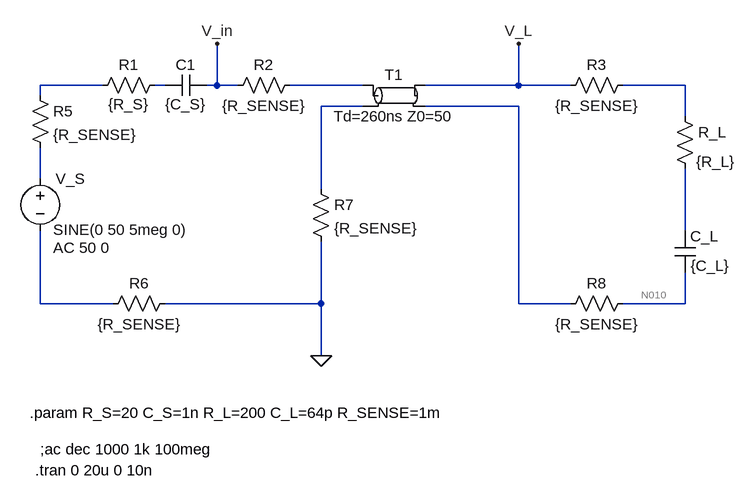
[diagram p0: schematic hw2_p3g_eantunano.asc]
hw2_p3g_eantunano.asc, the LTspice schematic file:
Version 4
SHEET 1 1288 680
WIRE 0 16 -96 16
WIRE 96 16 80 16
WIRE 176 16 176 -48
WIRE 176 16 160 16
WIRE 208 16 176 16
WIRE 400 16 288 16
WIRE 640 16 640 -48
WIRE 640 16 496 16
WIRE 720 16 640 16
WIRE 896 16 800 16
WIRE -96 32 -96 16
WIRE 400 48 336 48
WIRE 640 48 496 48
WIRE 896 64 896 16
WIRE -96 160 -96 112
WIRE 336 176 336 48
WIRE 896 240 896 144
WIRE -96 352 -96 240
WIRE 16 352 -96 352
WIRE 336 352 336 256
WIRE 336 352 96 352
WIRE 640 352 640 48
WIRE 720 352 640 352
WIRE 896 352 896 304
WIRE 896 352 800 352
WIRE 336 432 336 352
FLAG 336 432 0
FLAG 176 -48 V_in
FLAG 640 -48 V_L
SYMBOL voltage -96 144 R0
WINDOW 3 20 94 Left 2
WINDOW 123 20 122 Left 2
WINDOW 39 0 0 Left 0
SYMATTR InstName V_S
SYMATTR Value SINE(0 50 5meg 0)
SYMATTR Value2 AC 50 0
SYMBOL res 96 0 R90
WINDOW 0 0 56 VBottom 2
WINDOW 3 61 56 VBottom 2
SYMATTR InstName R1
SYMATTR Value {R_S}
SYMBOL res 880 48 R0
WINDOW 3 33 86 Left 2
SYMATTR InstName R_L
SYMATTR Value {R_L}
SYMBOL tline 448 32 R0
SYMATTR InstName T1
SYMATTR Value Td=260ns Z0=50
SYMBOL cap 160 0 R90
WINDOW 0 0 32 VBottom 2
WINDOW 3 61 32 VBottom 2
SYMATTR InstName C1
SYMATTR Value {C_S}
SYMBOL cap 880 240 R0
WINDOW 3 25 54 Left 2
SYMATTR InstName C_L
SYMATTR Value {C_L}
SYMBOL res 304 0 R90
WINDOW 0 0 56 VBottom 2
WINDOW 3 32 56 VTop 2
SYMATTR InstName R2
SYMATTR Value {R_SENSE}
SYMBOL res 816 0 R90
WINDOW 0 0 56 VBottom 2
WINDOW 3 32 56 VTop 2
SYMATTR InstName R3
SYMATTR Value {R_SENSE}
SYMBOL res -112 16 R0
SYMATTR InstName R5
SYMATTR Value {R_SENSE}
SYMBOL res 112 336 R90
WINDOW 0 0 56 VBottom 2
WINDOW 3 32 56 VTop 2
SYMATTR InstName R6
SYMATTR Value {R_SENSE}
SYMBOL res 320 160 R0
SYMATTR InstName R7
SYMATTR Value {R_SENSE}
SYMBOL res 816 336 R90
WINDOW 0 0 56 VBottom 2
WINDOW 3 32 56 VTop 2
SYMATTR InstName R8
SYMATTR Value {R_SENSE}
TEXT -112 520 Left 2 !.param R_S=20 C_S=1n R_L=200 C_L=64p R_SENSE=1m
TEXT -104 608 Left 2 !.tran 0 20u 0 10n
TEXT -96 576 Left 2 !;ac dec 1000 1k 100meg

The netlist it stands for:
* hw2_p3g_eantunano.asc
V_S N007 N009 SINE(0 50 5meg 0) AC 50 0
R1 N002 N001 {R_S}
R_L N004 N008 {R_L}
T1 N003 N005 V_L N006 Td=260ns Z0=50
C1 V_in N002 {C_S}
C_L N008 N010 {C_L}
R2 N003 V_in {R_SENSE}
R3 N004 V_L {R_SENSE}
R5 N001 N007 {R_SENSE}
R6 0 N009 {R_SENSE}
R7 N005 0 {R_SENSE}
R8 N010 N006 {R_SENSE}
.param R_S=20 C_S=1n R_L=200 C_L=64p R_SENSE=1m
.tran 0 20u 0 10n
;ac dec 1000 1k 100meg
.backanno
.end

* Results of the author's LTspice run, read from the files saved beside the schematic
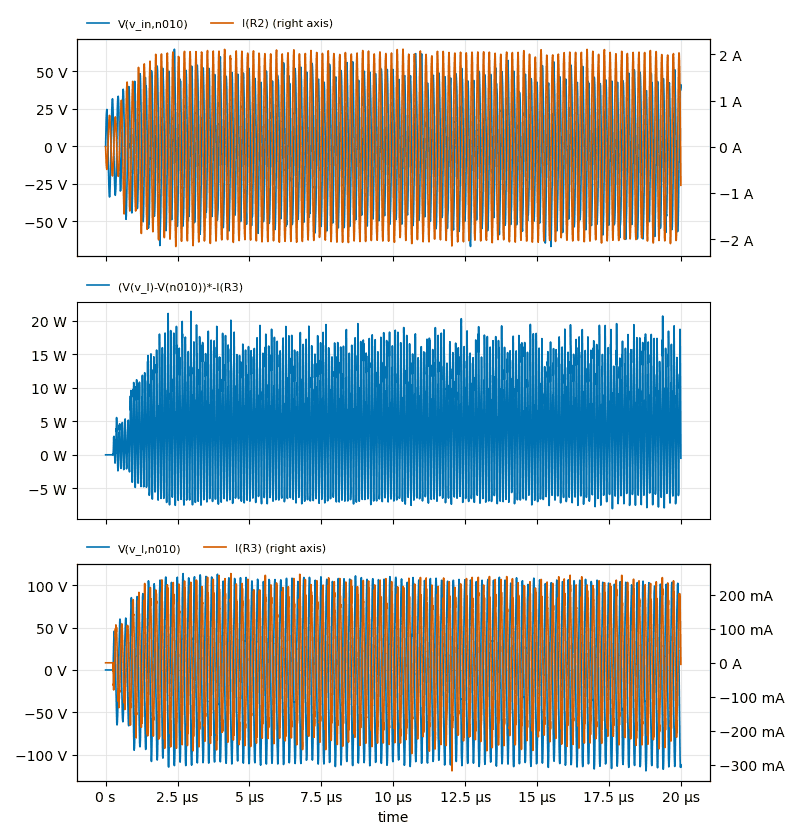
[diagram p1: Transient Analysis of hw2_p3g_eantunano.asc, plotted from the saved traces]
* Transient Analysis, 1 run:
*   V(v_in,n010): min -67.01 V, max 64.8 V, average -2.231 V, rms 35.17 V, last 37.71 V
*   I(R2): min -2.161 A, max 2.111 A, average 2.691 mA, rms 1.411 A, last -835.1 mA
*   (V(v_l)-V(n010))*-I(R3): min -8.042 W, max 21.41 W, average 4.27 W, rms 8.903 W, last -513.8 mW
*   V(v_l,n010): min -119.2 V, max 113.8 V, average -2.391 V, rms 75.38 V, last -114.4 V
*   I(R3): min -317.5 mA, max 262 mA, average 337.6 µA, rms 144.1 mA, last -4.493 mA